# EAGLE design Blueboard_Pro_v1.0 (EAGLE 6.3)
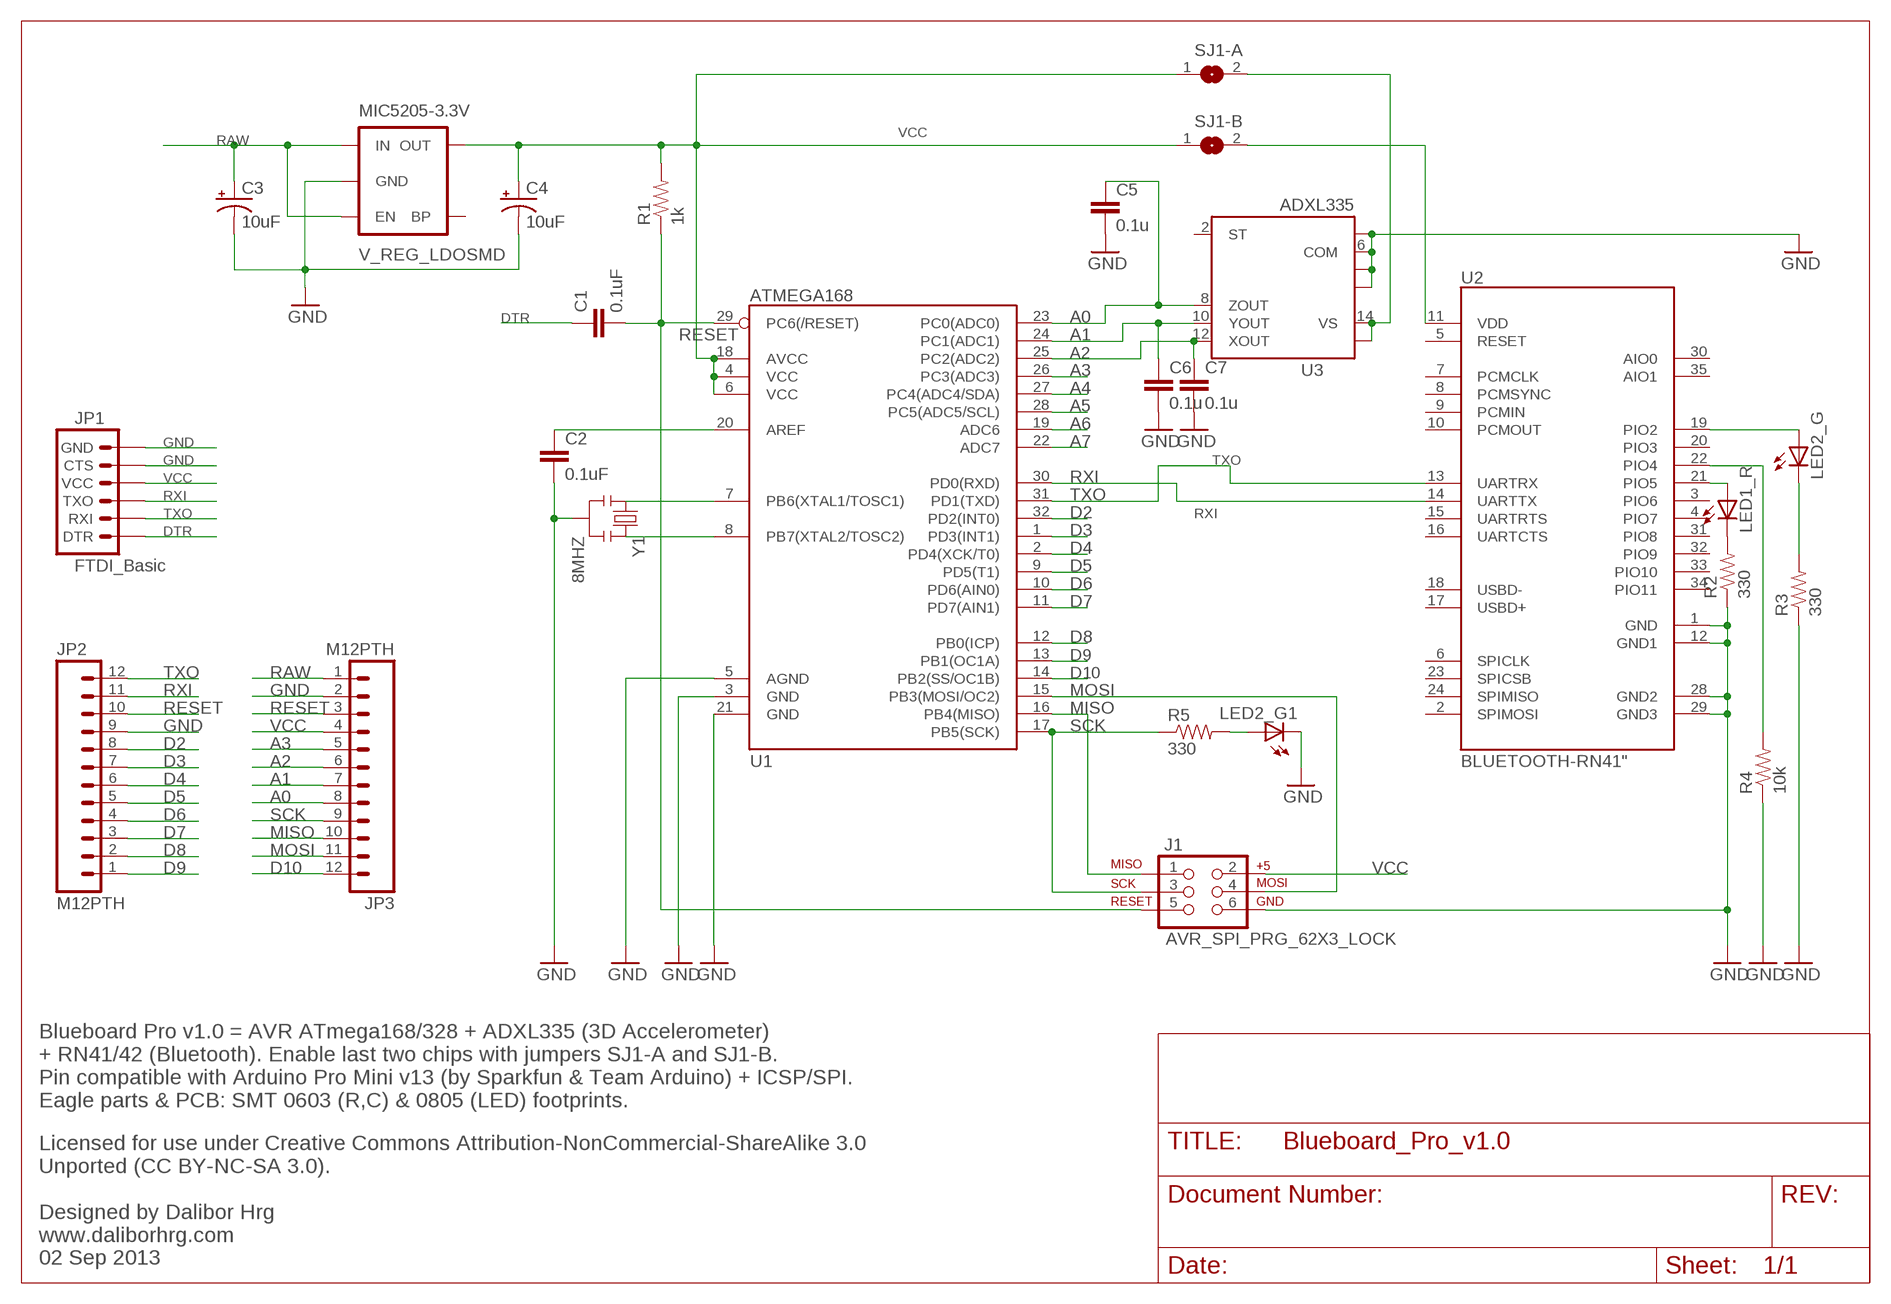
[diagram p0: schematic, sheet 1]

## Parts
C1  0.1uF  CAP0603-CAP  [0603-CAP]
C2  0.1uF  CAP0603-CAP  [0603-CAP]
C3  10uF  10UF-16V-10%(TANT)  [EIA3216]
C4  10uF  10UF-16V-10%(TANT)  [EIA3216]
C5  0.1u  CAP0603-CAP  [0603-CAP]
C6  0.1u  CAP0603-CAP  [0603-CAP]
C7  0.1u  CAP0603-CAP  [0603-CAP]
J1  AVR_SPI_PRG_62X3_LOCK  [2X3_LOCK]
JP1  FTDI_Basic  ARDUINO_SERIAL_PROGRAMPTH  [1X06]
JP2  M12PTH  [1X12]
JP3  M12PTH  [1X12]
LED1_R  LEDCHIP-LED0805  [CHIP-LED0805]
LED2_G  LEDCHIP-LED0805  [CHIP-LED0805]
LED2_G1  LEDCHIP-LED0805  [CHIP-LED0805]
MIC5205-3.3V  V_REG_LDOSMD  [SOT23-5]
R1  1k  1K-1%  [0603-RES]
R2  330  RESISTOR0603-RES  [0603-RES]
R3  330  RESISTOR0603-RES  [0603-RES]
R4  10k  RESISTOR0603  [0603-RES]
R5  330  RESISTOR0603-RES  [0603-RES]
SJ1-A  SJ  [SJ]
SJ1-B  SJ  [SJ]
U1  ATMEGA168  [TQFP32-08]
U2  BLUETOOTH-RN41"  [RN41]
U3  ADXL335  [LFCSP-16]
Y1  8MHZ  RESONATOR8MHZ  [RESONATOR-SMD]

## Nets
A0: C5.1 JP3.8 U1.23(PC0(ADC0)) U3.8(ZOUT)
A1: C6.1 JP3.7 U1.24(PC1(ADC1)) U3.10(YOUT)
A2: C7.1 JP3.6 U1.25(PC2(ADC2)) U3.12(XOUT)
A3: JP3.5 U1.26(PC3(ADC3))
A4: U1.27(PC4(ADC4/SDA))
A5: U1.28(PC5(ADC5/SCL))
A6: U1.19(ADC6)
A7: U1.22(ADC7)
D2: JP2.8 U1.32(PD2(INT0))
D3: JP2.7 U1.1(PD3(INT1))
D4: JP2.6 U1.2(PD4(XCK/T0))
D5: JP2.5 U1.9(PD5(T1))
D6: JP2.4 U1.10(PD6(AIN0))
D7: JP2.3 U1.11(PD7(AIN1))
D8: JP2.2 U1.12(PB0(ICP))
D9: JP2.1 U1.13(PB1(OC1A))
D10: JP3.12 U1.14(PB2(SS/OC1B))
DTR: C1.1 JP1.1(DTR)
GND: C2.2 C3.C(-) C4.C(-) C5.2 C6.2 C7.2 J1.6 JP1.5(CTS) JP1.6(GND) JP2.9 JP3.2 LED2_G1.C MIC5205-3.3V.2(GND) R2.1 R3.1 R4.1 U1.3(GND) U1.5(AGND) U1.21(GND) U2.1(GND) U2.12(GND1) U2.28(GND2) U2.29(GND3) U3.3(COM) U3.5(COM) U3.6(COM) U3.7(COM) Y1.2
MISO: J1.1 JP3.10 U1.16(PB4(MISO))
MOSI: J1.4 JP3.11 U1.15(PB3(MOSI/OC2))
N$1: LED2_G1.A R5.2
N$2: SJ1-A.2 U3.14(VS) U3.15(VS)
N$3: SJ1-B.2 U2.11(VDD)
N$8: U1.7(PB6(XTAL1/TOSC1)) Y1.1
N$9: U1.8(PB7(XTAL2/TOSC2)) Y1.3
N$26: C2.1 U1.20(AREF)
N$38: LED1_R.A U2.21(PIO5)
N$39: LED1_R.C R2.2
N$40: LED2_G.C R3.2
N$41: LED2_G.A U2.19(PIO2)
N$42: R4.2 U2.22(PIO4)
RAW: C3.A(+) JP3.1 MIC5205-3.3V.1(IN) MIC5205-3.3V.3(EN)
RESET: C1.2 J1.5 JP2.10 JP3.3 R1.1 U1.29(PC6(/RESET))
RXI: JP1.3(TXO) JP2.11 U1.30(PD0(RXD)) U2.14(UARTTX)
SCK: J1.3 JP3.9 R5.1 U1.17(PB5(SCK))
TXO: JP1.2(RXI) JP2.12 U1.31(PD1(TXD)) U2.13(UARTRX)
VCC: C4.A(+) J1.2 JP1.4(VCC) JP3.4 MIC5205-3.3V.5(OUT) R1.2 SJ1-A.1 SJ1-B.1 U1.4(VCC) U1.6(VCC) U1.18(AVCC)
Unconnected: MIC5205-3.3V.4(BP) U2.2(SPIMOSI) U2.3(PIO6) U2.4(PIO7) U2.5(RESET) U2.6(SPICLK) U2.7(PCMCLK) U2.8(PCMSYNC) U2.9(PCMIN) U2.10(PCMOUT) U2.15(UARTRTS) U2.16(UARTCTS) U2.17(USBD+) U2.18(USBD-) U2.20(PIO3) U2.23(SPICSB) U2.24(SPIMISO) U2.30(AIO0) U2.31(PIO8) U2.32(PIO9) U2.33(PIO10) U2.34(PIO11) U2.35(AIO1) U3.2(ST)

## Notes on the sheet
- Blueboard Pro v1.0 = AVR ATmega168/328 + ADXL335 (3D Accelerometer) 
  + RN41/42 (Bluetooth). Enable last two chips with jumpers SJ1-A and SJ1-B. 
  Pin compatible with Arduino Pro Mini v13 (by Sparkfun & Team Arduino) + ICSP/SPI.
  Eagle parts & PCB: SMT 0603 (R,C) & 0805 (LED) footprints.
- Licensed for use under Creative Commons Attribution-NonCommercial-ShareAlike 3.0
  Unported (CC BY-NC-SA 3.0).
  
  Designed by Dalibor Hrg
  www.daliborhrg.com
  02 Sep 2013

## Library data of the parts
C1 C5-C7 = SparkFun-Passives:CAP: Capacitor Standard 0603 ceramic capacitor, and 0.1" leaded capacitor.
C2 = SparkFun-Capacitors:CAP: Capacitor Standard 0603 ceramic capacitor, and 0.1" leaded capacitor.
C3 C4 = SparkFun-Capacitors:10UF-16V-10%(TANT): CAP-00811 1206/EIA-3216 Tantalum capacitor; PROD_ID: CAP-00811
J1 = SparkFun-Connectors:AVR_SPI_PRG_6: AVR ISP 6 Pin This is the reduced ISP connector for AVR programming. Common on Arduino. This footprint will take up less PCB space and can be used with a 10-pin to 6-pin adapter such as SKU: BOB-08508
JP1 = SparkFun-Connectors:ARDUINO_SERIAL_PROGRAM: FTDI connector footprints
JP2 JP3 = SparkFun-Connectors:M12: Header 12 Standard 12-pin 0.1" header. Use with straight break away headers (SKU : PRT-00116), right angle break away headers (PRT-00553), swiss pins (PRT-00743), machine pins (PRT-00117), and female headers (PRT-00115).
LED1_R LED2_G LED2_G1 = adafruit:LED: LED OSRAM: - CHIPLED LG R971, LG N971, LY N971, LG Q971, LY Q971, LO R971, LY R971 LH N974, LH R974 LS Q976, LO Q976, LY Q976 LO Q996 - Hyper CHIPLED LW Q18S LB Q993, LB Q99A, LB R99A - SideLED LS A670, LO A670, LY A670, LG A670, LP A670 LB A673, LV A673, LT A673, LW A673 LH A674 LY A675 LS A676, LA A676, LO A676, LY A676, LW A676 LS A679, LY A679, LG A679 - Hyper Micro SIDELED® LS Y876, LA Y876, LO Y876, LY Y876 LT Y87S - SmartLED LW L88C, LW L88S LB L89C, LB L89S, LG L890 LS L89K, LO L89K, LY L89K LS L896, LA L896, LO L896, LY L896 - TOPLED LS T670, LO T670, LY T670, LG T670, LP T670 LSG T670, LSP T670, LSY T670, LOP T670, LYG T670 LG T671, LOG T671, LSG T671 LB T673, LV T673, LT T673, LW T673 LH T674 LS T676, LA T676, LO T676, LY T676, LB T676, LH T676, LSB T676, LW T676 LB T67C, LV T67C, LT T67C, LS T67K, LO T67K, LY T67K, LW E67C LS E67B, LA E67B, LO E67B, LY E67B, LB E67C, LV E67C, LT E67C LW T67C LS T679, LY T679, LG T679 LS T770, LO T770, LY T770, LG T770, LP T770 LB T773, LV T773, LT T773, LW T773 LH T774 LS E675, LA E675, LY E675, LS T675 LS T776, LA T776, LO T776, LY T776, LB T776 LHGB T686 LT T68C, LB T68C - Hyper Mini TOPLED® LB M676 - Mini TOPLED Santana® LG M470 LS M47K, LO M47K, LY M47K Source: http://www.osram.convergy.de/
MIC5205-3.3V = SparkFun-PowerIC:V_REG_LDO: Voltage Regulator LDO Standard 150mA LDO voltage regulator in SOT-23 layout. Micrel part MIC5205. BP (by-pass) pin is used to lower output noise with 470pF cap.
R1 = SparkFun-Resistors:1K-1%: 1k-ohm SMT 1/10W - 1% (0603) RES-07856; PROD_ID: RES-07856
R2 R3 R5 = SparkFun-Passives:RESISTOR: Resistor Basic schematic elements and footprints for 0603, 1206, and PTH resistors.
R4 = SparkFun-Resistors:RESISTOR: Resistor Basic schematic elements and footprints for 0603, 1206, and PTH resistors.
SJ1-A SJ1-B = jumper:SJ: SMD solder JUMPER
U1 = SparkFun-DigitalIC:ATMEGA168: Atmel 32-pin 8-bit micro, 16k flash.
U2 = SparkFun-RF:BLUETOOTH-RN41: Bluetooth SMD module
U3 = SparkFun-Sensors:ADXL335: 3-axis, 3g accelerometer, analog out
Y1 = SparkFun-FreqCtrl:RESONATOR: Resonator Small SMD resonator. Used, eg, on the Arduino Pro/ Pro Mini boards. 8MHz- XTAL-08895 16MHz- XTAL-08900; PROD_ID: XTAL-08895

## Board
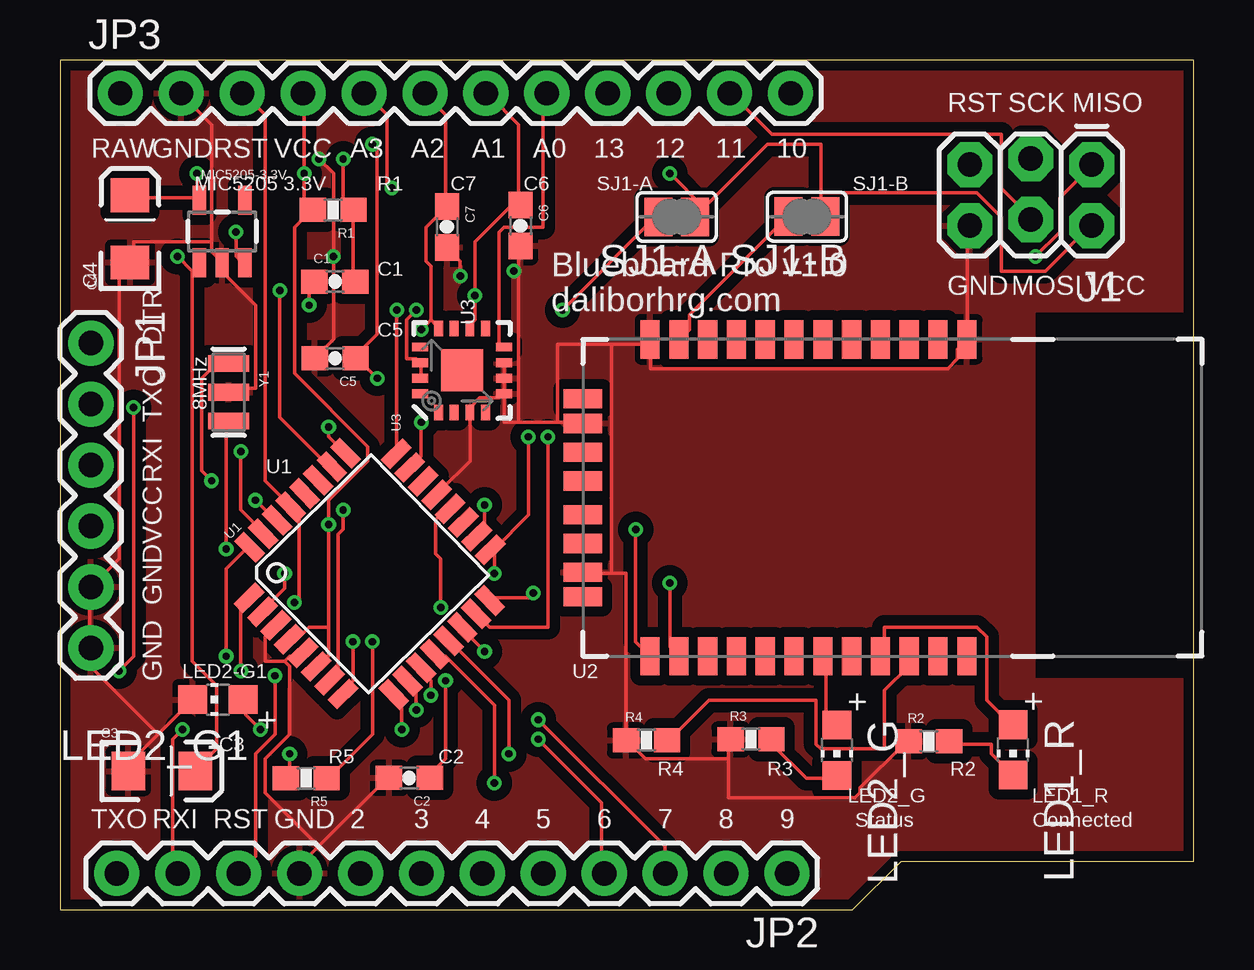
[diagram p1: board, top side]
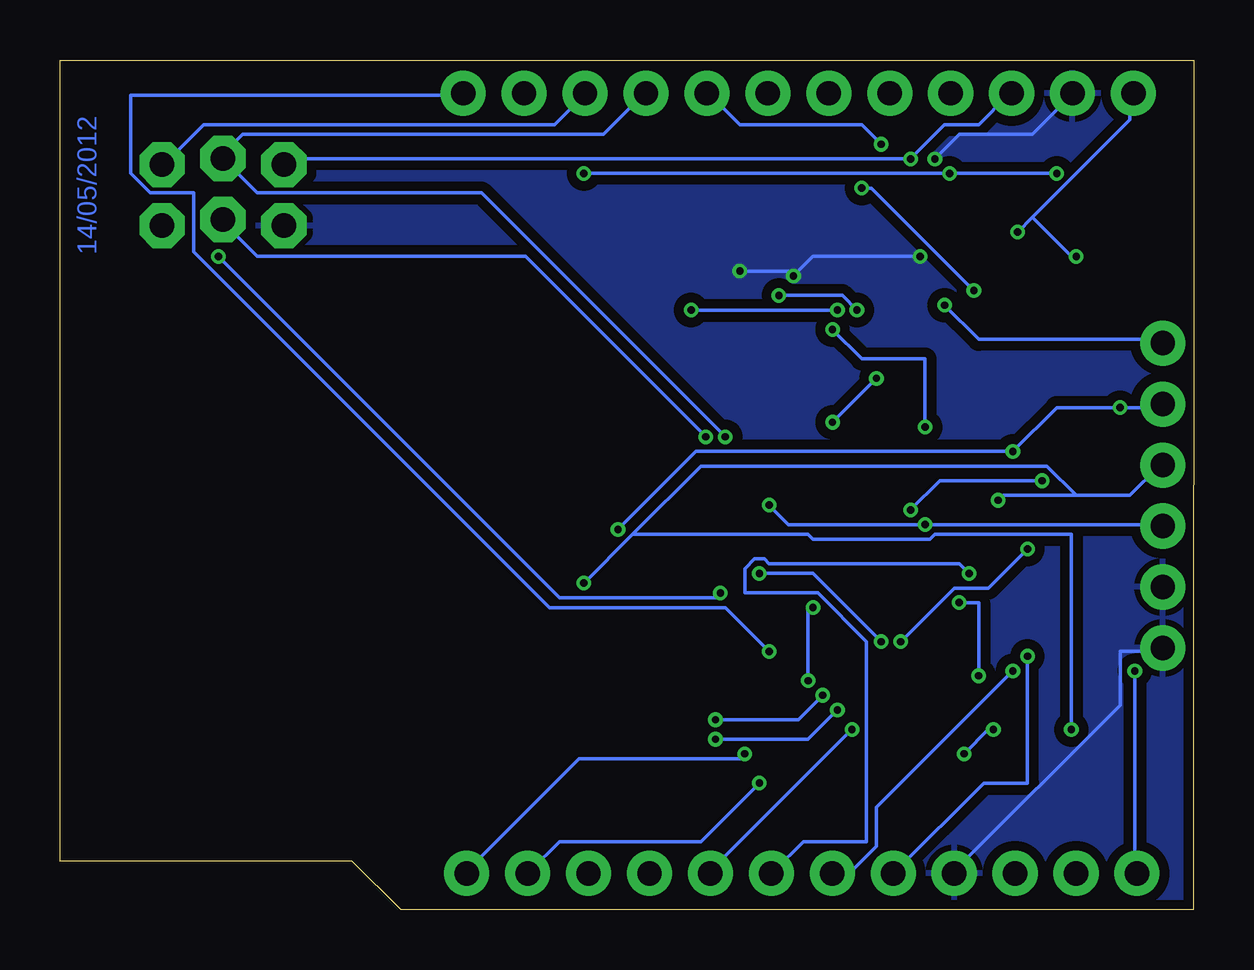
[diagram p2: board, bottom side, seen from below]

Size 47.26 x 35.41 mm. Coordinates in mm from the lower left corner, seen from the top.
Outline: 0.02,0 33.04,0 35.07,2.03 47.26,2.03 47.26,35.41 0,35.41 0.02,0
Copper layers (1*16): Top 0.035mm / dielectric 1.5mm / Bottom 0.035mm
Design rules "Elecrow_2-layer_eagle_rule": minimum track width 6mil, minimum drill 12mil, track to track 6mil, track to pad 6mil, pad to pad 6mil, via to via 6mil, smd to smd 0mil, copper to edge 10mil, drill to drill 10mil, minimum pad ring 10mil, minimum via ring 6mil, stop-mask expansion 2mil, vias tented up to drill 100mil, thermal gap 10mil

### Footprints (pad centres in the part's own frame; a part is rotated, then mirrored left to right if it is on the bottom)
0603-CAP = smd 1.1 x 1: 1 -0.85,0; 2 0.85,0
EIA3216 = smd 1.4 x 1.6: A 1.4,0; C -1.4,0
2X3_LOCK = drill 1.016 pad 1.88 octagon: 1 0,0; 2 0,2.54; 3 2.54,-0.254; 4 2.54,2.286; 5 5.08,0; 6 5.08,2.54
1X06 = drill 1.016 pad 1.88: 1 0,0; 2 2.54,0; 3 5.08,0; 4 7.62,0; 5 10.16,0; 6 12.7,0
1X12 = drill 1.016 pad 1.88: 1 0,0; 2 2.54,0; 3 5.08,0; 4 7.62,0; 5 10.16,0; 6 12.7,0; 7 15.24,0; 8 17.78,0; 9 20.32,0; 10 22.86,0; 11 25.4,0; 12 27.94,0
CHIP-LED0805 = smd 1.2 x 1.2: A 0,-1.05; C 0,1.05
SOT23-5 = smd 0.55 x 1.2: 1 -0.95,-1.3; 2 0,-1.3; 3 0.95,-1.3; 4 0.95,1.3; 5 -0.95,1.3
0603-RES = smd 1.1 x 1: 1 -0.85,0; 2 0.85,0
SJ = smd 1.168 x 1.6: 1 -0.762,0; 2 0.762,0
TQFP32-08 = smd 1.27 x 0.559: 1 -4.293,2.8; 2 -4.293,2; 3 -4.293,1.2; 4 -4.293,0.4; 5 -4.293,-0.4; 6 -4.293,-1.2; 7 -4.293,-2; 8 -4.293,-2.8; 17 4.293,-2.8; 18 4.293,-2; 19 4.293,-1.2; 20 4.293,-0.4; 21 4.293,0.4; 22 4.293,1.2; 23 4.293,2; 24 4.293,2.8 | smd 0.559 x 1.27: 9 -2.8,-4.293; 10 -2,-4.293; 11 -1.2,-4.293; 12 -0.4,-4.293; 13 0.4,-4.293; 14 1.2,-4.293; 15 2,-4.293; 16 2.8,-4.293; 25 2.8,4.293; 26 2,4.293; 27 1.2,4.293; 28 0.4,4.293; 29 -0.4,4.293; 30 -1.2,4.293; 31 -2,4.293; 32 -2.8,4.293
RN41 = smd 0.8 x 1.6: 1 -6.6,-6.6; 2 -5.4,-6.6; 3 -4.2,-6.6; 4 -3,-6.6; 5 -1.8,-6.6; 6 -0.6,-6.6; 7 0.6,-6.6; 8 1.8,-6.6; 9 3,-6.6; 10 4.2,-6.6; 11 5.4,-6.6; 12 6.6,-6.6; 13 6.6,6.6; 14 5.4,6.6; 15 4.2,6.6; 16 3,6.6; 17 1.8,6.6; 18 0.6,6.6; 19 -0.6,6.6; 20 -1.8,6.6; 21 -3,6.6; 22 -4.2,6.6; 23 -5.4,6.6; 24 -6.6,6.6 | smd 1.6 x 0.8: 28 9.4,3.1; 29 9.4,-3.1; 30 9.4,4.122; 31 9.4,1.9; 32 9.4,0.7; 33 9.4,-0.7; 34 9.4,-1.9; 35 9.4,-4.122
LFCSP-16 = smd 1.75 x 1.75: 0 0,0 | smd 0.65 x 0.37: 1 -1.75,0.975; 2 -1.75,0.325; 3 -1.75,-0.325; 4 -1.75,-0.975; 9 1.75,-0.975; 10 1.75,-0.325; 11 1.75,0.325; 12 1.75,0.975 | smd 0.37 x 0.65: 5 -0.975,-1.75; 6 -0.325,-1.75; 7 0.325,-1.75; 8 0.975,-1.75; 13 0.975,1.75; 14 0.325,1.75; 15 -0.325,1.75; 16 -0.975,1.75
RESONATOR-SMD = smd 0.7 x 1.7: 1 -1.2,0; 2 0,0; 3 1.2,0

### Placement (x,y rotation side)
C1  11.46,26.17 0 top
C2  14.56,5.5 180 top
C3  4.25,5.79 0 top
C4  2.92,28.38 90 top
C5  11.47,22.98 180 top
C6  19.19,28.51 270 top
C7  16.13,28.46 270 top
J1  43.01,31.05 180 top
JP1  1.29,23.61 270 top
JP2  30.31,1.52 180 top
JP3  2.51,34.03 0 top
LED1_R  39.73,6.67 180 top
LED2_G  32.39,6.65 180 top
LED2_G1  6.58,8.77 90 top
MIC5205-3.3V  6.76,28.27 0 top
R1  11.39,29.16 180 top
R2  36.22,7.02 0 top
R3  28.8,7.11 0 top
R4  24.45,7.07 0 top
R5  10.26,5.48 180 top
SJ1-A  25.7,28.88 180 top
SJ1-B  31.14,28.88 180 top
U1  12.91,14 44.4 top
U2  31.2,17.17 180 top
U3  16.76,22.48 90 top
Y1  7.03,21.57 270 top

### Tracks (layer width: path | path; a pad name or v marks a point on that pad's centre or on a via)
A0  (via drill 0.3)
  Top 0.152: U3.8 18.31,23.57 18.31,28.25 18.51,28.45 20.14,28.45 20.14,33.93 JP3.8 | v13.03,31.9 13.23,31.7 13.23,23.98 12.41,23.16 C5.1 12.41,22.96 v13.23,22.15 | v15.06,20.32 15.06,18.9 14.65,18.49 U1.23
  Bottom 0.152: v13.03,31.9 13.84,32.72 18.92,32.72 20.14,33.93 JP3.8 | v13.23,22.15 v15.06,20.32
A1  (via drill 0.3)
  Top 0.152: U3.10 17.09,24.38 17.29,24.59 v17.29,25.6 17.29,27.84 18.71,29.26 19.12,29.26 C6.1 19.12,29.46 19.12,32.72 17.9,33.93 JP3.7 | v14.04,24.99 14.04,19.1 U1.24
  Bottom 0.152: v14.04,24.99 14.65,25.6 v17.29,25.6
A2  (via drill 0.3)
  Top 0.152: 15.46,24.59 15.67,24.38 U3.12 | 15.46,24.59 15.46,26.82 15.26,27.03 15.26,28.45 16.07,29.26 C7.1 16.07,29.46 16.07,33.12 15.26,33.93 JP3.6 | v11.2,20.12 11.2,19.71 11.81,19.1 U1.25 | 15.46,24.59 v15.06,24.18
  Bottom 0.152: v11.2,20.12 11.2,22.96 13.84,22.96 v15.06,24.18
A3  (via drill 0.3)
  Top 0.152: v9.16,25.81 9.16,20.52 11.2,18.49 U1.26 | v13.84,30.07 13.63,30.28 13.63,33.12 12.82,33.93 JP3.5
  Bottom 0.152: v9.16,25.81 13.43,30.07 v13.84,30.07
D2  (via drill 0.3)
  Top 0.152: v6.93,10.57 6.93,14.22 7.74,15.04 U1.32
  Bottom 0.152: v6.93,10.57 6.93,5.28 8.76,5.28 12.41,1.63 JP2.8
D3  (via drill 0.3)
  Top 0.152: v7.54,9.96 7.54,12.6 7.74,12.8 U1.1
  Bottom 0.152: v7.54,9.96 13.23,4.27 13.23,2.64 14.24,1.63 15.06,1.63 JP2.7
D4  (via drill 0.3)
  Top 0.152: v9.37,14.02 9.37,13.41 8.55,12.6 U1.2
  Bottom 0.152: v9.37,14.02 9.77,14.43 17.7,14.43 17.9,14.63 18.31,14.63 18.71,14.22 18.71,13.21 15.67,13.21 13.63,11.18 13.63,2.85 16.28,2.85 17.5,1.63 JP2.6
D5  (via drill 0.3)
  Top 0.152: v14.24,7.52 14.24,8.74 14.04,8.94 U1.9
  Bottom 0.152: v14.24,7.52 20.14,1.63 JP2.5
D6  (via drill 0.3)
  Top 0.152: v14.85,8.33 14.85,9.14 14.65,9.35 U1.10 | v19.93,7.11 22.57,4.47 22.57,1.63 JP2.4
  Bottom 0.152: v14.85,8.33 16.07,7.11 v19.93,7.11
D7  (via drill 0.3)
  Top 0.152: v15.46,8.94 15.46,9.55 15.06,9.96 U1.11 | v19.93,7.92 25.22,2.64 25.22,1.63 JP2.3
  Bottom 0.152: v15.46,8.94 16.48,7.92 v19.93,7.92
D8  (via drill 0.3)
  Top 0.152: v18.11,5.28 18.11,8.53 16.07,10.57 15.67,10.57 U1.12
  Bottom 0.152: v18.11,5.28 20.54,2.85 26.44,2.85 27.66,1.63 JP2.2
D9  (via drill 0.3)
  Top 0.152: v18.71,6.5 18.71,8.74 16.28,11.18 U1.13
  Bottom 0.152: v18.71,6.5 18.92,6.3 25.62,6.3 30.3,1.63 JP2.1
D10  (via drill 0.3)
  Top 0.152: v17.7,10.77 16.89,11.58 U1.14
  Bottom 0.152: v17.7,10.77 19.53,12.6 26.84,12.6 41.68,27.43 41.68,29.87 43.51,29.87 44.32,30.68 44.32,33.93 30.5,33.93 JP3.12
DTR  (via drill 0.3)
  Top 0.152: v10.38,25.2 10.38,25.81 10.59,26.01 C1.1
  Bottom 0.152: v10.38,25.2 8.96,23.77 1.44,23.77 JP1.1
GND  (via drill 0.3)
  Top 0.152: 27.86,6.3 24.4,6.3 23.79,6.91 R4.1 23.59,7.11 23.59,14.02 22.98,14.02 | 27.86,6.3 27.86,6.91 R3.1 | 27.86,6.3 27.86,4.67 33.14,4.67 33.35,4.88 33.35,5.08 35.17,6.91 R2.1 | 22.98,14.02 21.97,14.02 U2.28 | J1.6 37.82,28.45 37.82,23.77 U2.1 37.61,23.57 37.41,23.37 37.41,22.96 37,22.55 24.61,22.55 24.61,23.57 U2.12 24.4,23.57 22.98,23.57 | v16.68,26.42 16.68,27.03 16.28,27.43 C7.2 | C6.2 19.12,27.64 19.12,26.82 v18.92,26.62 19.12,26.42 19.12,20.32 | U3.6 18.51,22.76 U3.7 | U3.5 18.31,21.34 17.5,21.34 17.09,20.93 U3.3 17.09,18.69 15.87,17.48 U1.21 | U3.6 18.51,21.54 U3.5 | U3.6 | 19.12,20.32 18.51,20.32 18.51,21.34 U3.5 | 19.12,20.32 20.75,20.32 | 20.75,20.32 21.76,20.32 U2.29 | 22.98,23.57 20.75,23.57 20.75,20.32 | 22.98,23.57 22.98,14.02 | 9.37,10.36 9.57,10.57 9.98,10.57 U1.5 | 9.37,10.36 8.55,10.36 8.55,11.38 8.96,11.79 U1.3 | 10.79,2.64 10.18,2.03 10.18,1.63 JP2.9 | 10.79,2.64 13.63,5.49 C2.2 | 9.37,10.36 9.57,10.16 9.57,7.32 8.55,6.3 8.55,4.88 10.79,2.64 | 4.08,7.32 2.87,6.1 2.87,5.89 C3.C | 4.08,7.32 5.51,8.74 LED2_G1.C | 4.08,7.32 1.44,9.96 1.44,10.77 JP1.6 1.24,10.97 1.24,13.41 JP1.5 1.44,13.61 2.46,14.63 2.46,26.42 2.87,26.82 C4.C 3.07,27.03 3.07,27.84 6.32,27.84 | 6.32,27.84 6.32,27.43 6.73,27.03 MIC5205-3.3V.2 6.93,26.82 6.93,26.42 8.15,25.2 8.15,21.74 7.13,21.74 Y1.2 | v10.79,31.29 11.4,30.68 v11.4,27.23 11.4,23.77 10.79,23.16 C5.2 | 6.32,27.84 6.32,32.72 5.1,33.93 JP3.2
  Bottom 0.152: v18.92,26.62 16.89,26.62 v16.68,26.42 15.87,27.23 v11.4,27.23 | v10.79,31.29 9.77,32.31 6.73,32.31 5.1,33.93 JP3.2 | JP2.9 9.98,1.63 3.07,8.53 3.07,10.77 1.44,10.77 JP1.6
  pour Top (isolate 0.432): 0.02,35.56 47.26,35.56 47.26,24.89 40.66,24.89 40.66,9.65 47.26,9.65 47.26,2.03 35.07,2.03 33.04,0 0.02,0
  pour Bottom (isolate 0.406): 0.02,35.56 47.26,35.56 47.26,24.89 40.66,24.89 40.66,9.65 47.26,9.65 47.26,2.03 35.07,2.03 33.04,0 0.02,0
MISO  (via drill 0.3)
  Top 0.152: v19.73,13.21 19.73,13.01 18.11,13.01 U1.16 | v40.66,27.23 41.68,28.25 41.68,29.67 42.9,30.89 J1.1
  Bottom 0.152: v19.73,13.21 19.93,13.01 26.44,13.01 v40.66,27.23 | JP3.10 25.42,33.93 26.64,32.72 41.27,32.72 42.9,31.09 J1.1
MOSI  (via drill 0.3)
  Top 0.152: v20.34,19.71 20.34,11.79 17.9,11.79 17.5,12.19 U1.15 | JP3.11 28.06,33.93 29.69,32.31 39.24,32.31 39.24,30.07 40.46,28.85 J1.4
  Bottom 0.152: v20.34,19.71 27.86,27.23 39.03,27.23 40.46,28.65 J1.4
N$1  (via drill 0.3)
  Top 0.152: v9.57,6.5 9.57,5.49 R5.2 | v8.35,7.52 7.74,8.13 7.74,8.74 LED2_G1.A
  Bottom 0.152: v9.57,6.5 8.55,7.52 v8.35,7.52
N$2  (via drill 0.3)
  Top 0.152: U3.15 15.06,22.15 15.06,22.76 U3.14 14.85,22.96 14.45,22.96 14.45,24.59 v14.85,24.99 | v20.95,24.99 24.81,28.85 SJ1-A.2
  Bottom 0.152: v20.95,24.99 v14.85,24.99
N$3
  Top 0.152: U2.11 25.83,23.77 26.23,24.18 26.23,24.79 30.3,28.85 SJ1-B.2
N$8  (via drill 0.3)
  Top 0.152: v11.81,16.66 11.81,15.85 11.6,15.65 11.6,9.96 11.4,9.75 U1.7 | v6.32,17.88 5.91,18.29 5.91,22.15 6.52,22.76 6.93,22.76 Y1.1
  Bottom 0.152: v11.81,16.66 10.59,17.88 v6.32,17.88
N$9  (via drill 0.3)
  Top 0.152: v12.21,11.18 12.21,9.55 11.81,9.14 U1.8 | v6.93,15.04 6.93,20.32 Y1.3
  Bottom 0.152: v12.21,11.18 9.98,13.41 8.55,13.41 v6.93,15.04
N$26  (via drill 0.3)
  Top 0.152: v16.07,9.55 16.07,6.3 15.46,5.69 C2.1 | v15.87,12.6 15.87,14.63 15.67,14.83 15.67,16.26 16.07,16.66 U1.20
  Bottom 0.152: v16.07,9.55 16.07,12.6 v15.87,12.6
N$38
  Top 0.152: LED1_R.A 39.64,7.72 38.63,8.74 38.63,11.38 38.22,11.79 34.36,11.79 34.36,10.77 U2.21
N$39
  Top 0.152: R2.2 37.21,6.91 38.83,6.91 38.83,6.5 39.64,5.69 LED1_R.C
N$40
  Top 0.152: R3.2 29.69,6.91 31.11,5.49 32.33,5.49 LED2_G.C
N$41
  Top 0.152: LED2_G.A 32.33,7.72 31.92,8.13 31.92,10.57 U2.19
N$42
  Top 0.152: R4.2 25.42,7.11 27.05,8.74 31.52,8.74 31.52,6.91 31.72,6.71 34.36,6.71 34.36,9.14 35.38,10.16 35.38,10.57 U2.22
RAW  (via drill 0.3)
  Top 0.152: v7.33,28.25 7.33,27.23 7.54,27.03 MIC5205-3.3V.3 | 5.51,26.62 5.71,26.82 MIC5205-3.3V.1 | 5.51,26.62 5.51,10.36 6.52,9.35 6.52,6.71 5.71,5.89 C3.A | 5.51,26.62 v4.9,27.23
  Bottom 0.152: 6.73,28.85 2.66,32.92 2.66,33.93 JP3.1 | 6.73,28.85 v7.33,28.25 | 6.73,28.85 5.1,27.23 v4.9,27.23
RESET  (via drill 0.3)
  Top 0.152: C1.2 12.21,26.21 12.21,29.06 R1.1 12.21,29.26 11.81,29.67 v11.81,31.29 | JP3.3 7.74,33.93 8.55,33.12 8.55,17.88 9.57,16.87 U1.29 9.77,16.66 9.98,16.46 9.98,13.01 v9.77,12.8 | v8.96,9.75 8.96,7.32 8.15,6.5 8.15,2.23 7.54,1.63 JP2.10
  Bottom 0.152: JP3.3 7.74,33.93 8.96,32.72 10.38,32.72 v11.81,31.29 37.61,31.29 37.82,31.09 J1.5 | v8.96,9.75 8.96,12.8 v9.77,12.8
RXI  (via drill 0.3)
  Top 0.152: v8.15,17.07 8.96,16.26 U1.30 | v25.42,13.61 25.42,10.97 25.62,10.77 U2.14 | v5.1,7.52 4.69,7.11 4.69,1.83 4.9,1.63 JP2.11
  Bottom 0.152: v8.15,17.07 7.94,17.27 4.9,17.27 | 4.9,17.27 2.66,17.27 1.44,18.49 JP1.3 | 23.39,15.65 20.54,18.49 6.12,18.49 4.9,17.27 | 23.39,15.65 v25.42,13.61 | v5.1,7.52 5.1,15.65 10.79,15.65 10.99,15.44 15.87,15.44 16.07,15.65 23.39,15.65
SCK  (via drill 0.3)
  Top 0.152: v13.03,11.18 13.03,7.32 11.2,5.49 R5.1 | v18.11,14.02 18.11,14.83 U1.17 18.11,15.04 19.53,16.46 v19.53,19.71
  Bottom 0.152: v13.03,11.18 15.87,14.02 v18.11,14.02 | JP3.9 22.98,33.93 24.61,32.31 39.64,32.31 40.46,31.5 J1.3 40.46,31.29 39.03,29.87 29.69,29.87 v19.53,19.71
TXO  (via drill 0.3)
  Top 0.152: v7.54,19.1 7.54,16.66 8.35,15.85 U1.31 | v24,15.85 24,11.18 24.4,10.77 U2.13 | v2.46,9.96 3.07,10.57 v3.07,20.93
  Bottom 0.152: JP1.2 1.44,20.93 v3.07,20.93 5.71,20.93 v7.54,19.1 20.75,19.1 v24,15.85 | v2.46,9.96 2.46,1.63 JP2.12
VCC  (via drill 0.3)
  Top 0.152: 26.84,29.26 29.48,31.9 31.72,31.9 31.72,29.87 | 26.84,29.26 26.64,29.06 SJ1-A.1 26.84,29.26 | 31.72,29.87 31.72,29.06 SJ1-B.1 | 31.72,29.87 38.22,29.87 39.24,28.85 39.24,26.62 41.07,26.62 42.9,28.45 J1.2 | v17.7,16.87 17.7,15.85 17.5,15.65 U1.18 | 5.71,29.67 3.07,29.67 C4.A | 11.2,11.79 10.38,11.79 9.98,11.38 9.57,11.38 U1.4 | 11.2,11.79 11.2,10.57 10.79,10.16 U1.6 | JP3.4 10.18,33.93 v10.18,30.68 10.18,29.46 10.38,29.26 R1.2 10.38,29.06 9.77,28.45 9.77,22.35 12.82,19.3 12.82,18.69 11.2,17.07 v11.2,16.05 11.2,11.79 | v5.71,30.68 5.71,29.67 | 5.71,29.67 MIC5205-3.3V.5 | v25.42,30.68 26.84,29.26
  Bottom 0.152: v17.7,16.87 16.89,16.05 v11.2,16.05 1.44,16.05 JP1.4 | v5.71,30.68 v10.18,30.68 v25.42,30.68

### Text on the board
Bottom: 14/05/2012
tPlace: RST | SCK | MISO | RAW | GND | RST | VCC | A3 | A2 | A1 | A0 | 13 | 12 | 11 | 10 | MIC5205 3.3V | R1 | C7 | C6 | SJ1-A | SJ1-B | C4 | C1 | Blueboard Pro v1.0 / daliborhrg.com | GND | MOSI | VCC | C5 | U3 | DTR | 8MHz | TXO | U1 | RXI | VCC | GND | GND | LED2-G1 | U2 | C3 | R5 | C2 | R4 | R3 | R2 | LED2_G | LED1_R | TXO | RXI | RST | GND | 2 | 3 | 4 | 5 | 6 | 7 | 8 | 9 | Status | Connected